# EAGLE design NXPESC-UF1_test003 (EAGLE 7.3.0)

## Sheet 1 of 3
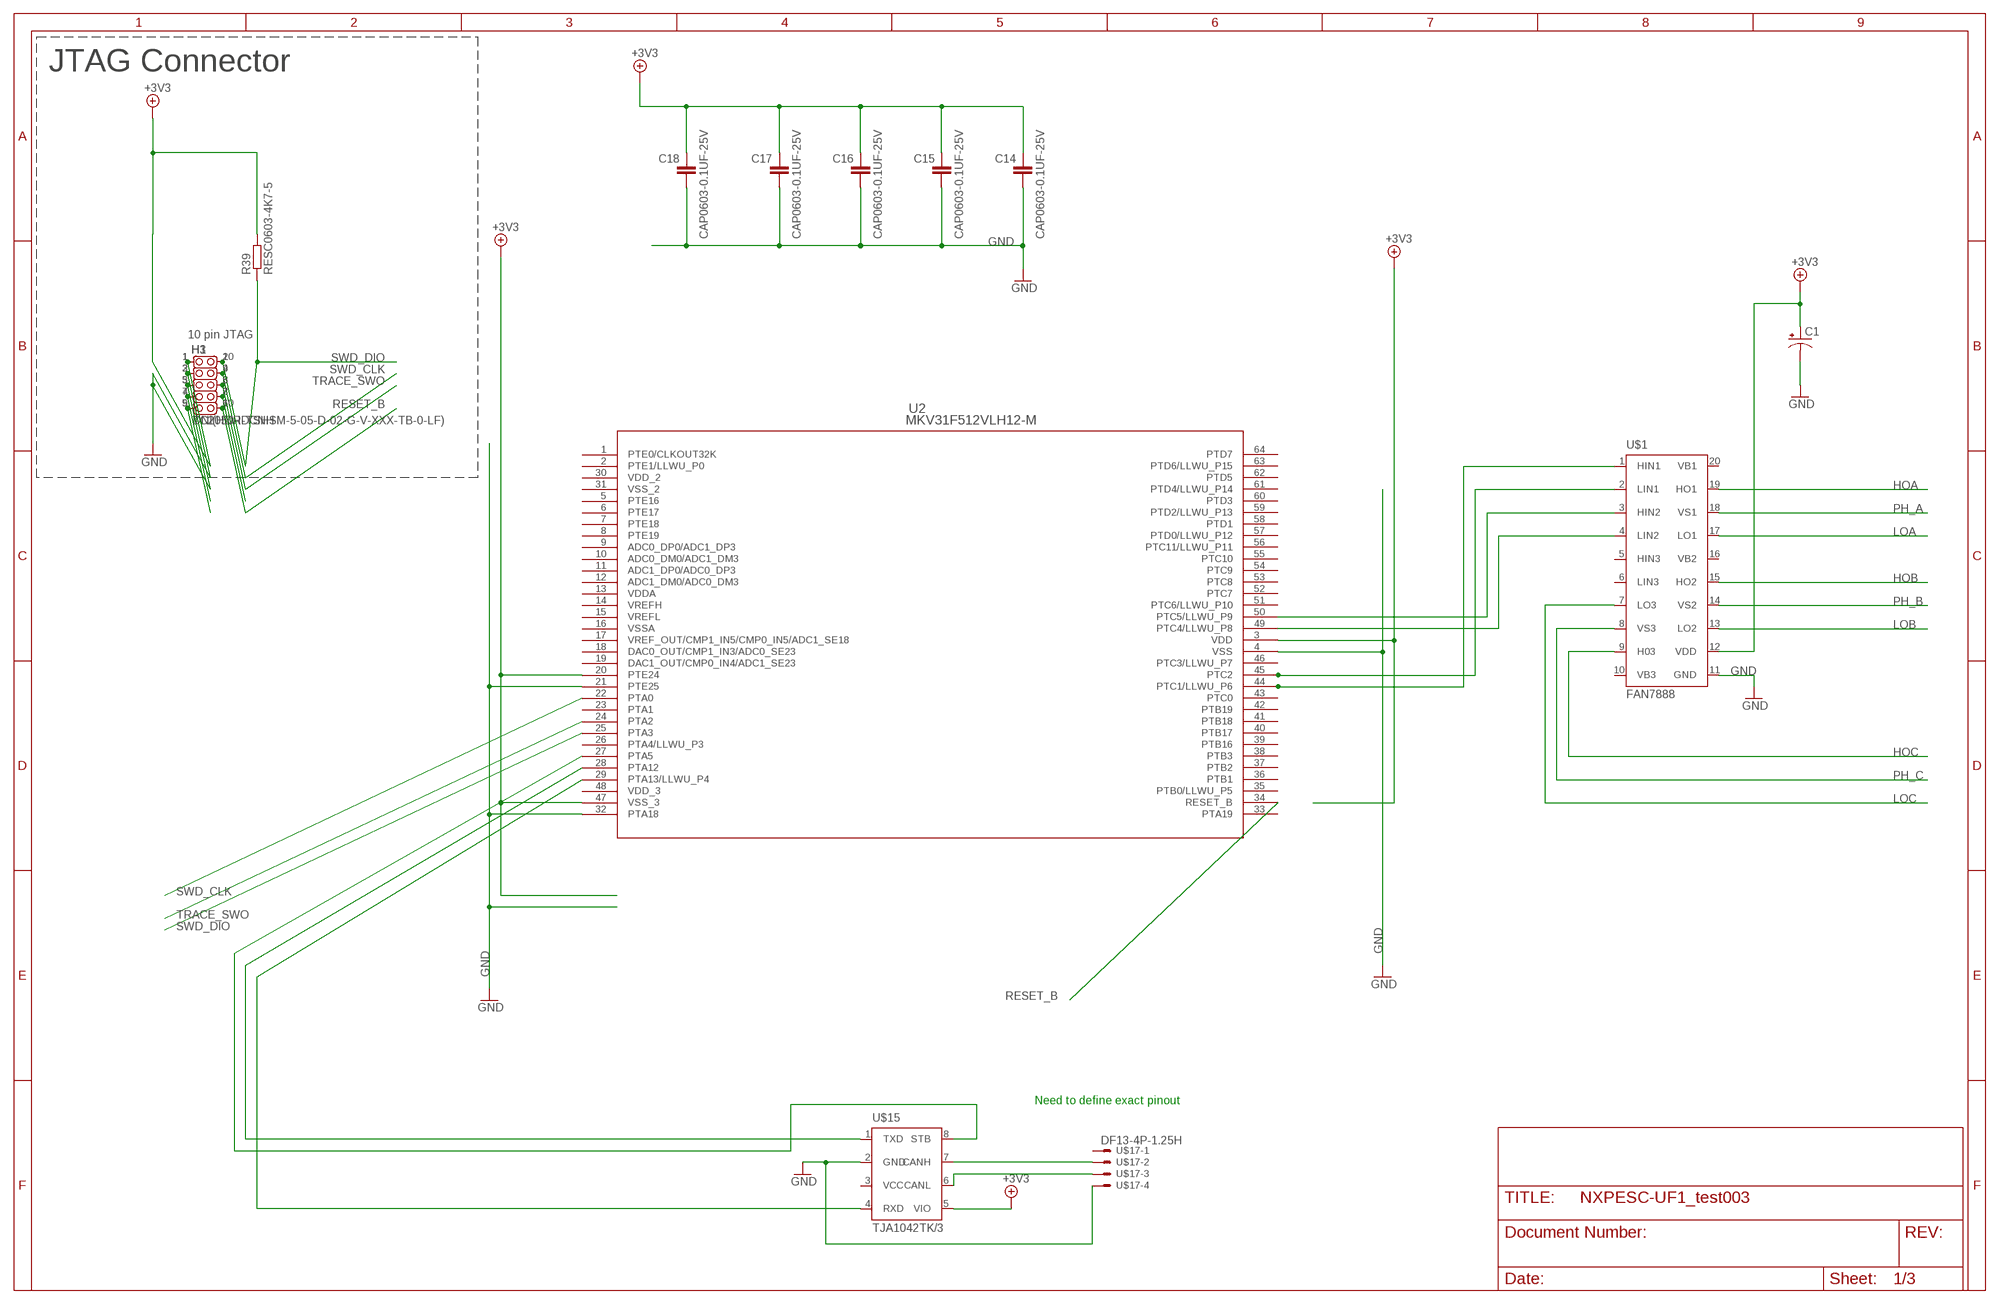
[diagram p0: schematic, sheet 1]

### Parts
C1  CAP_POL1206  [EIA3216]
C14  CAP0603-0.1UF-25V  [C0603]
C15  CAP0603-0.1UF-25V  [C0603]
C16  CAP0603-0.1UF-25V  [C0603]
C17  CAP0603-0.1UF-25V  [C0603]
C18  CAP0603-0.1UF-25V  [C0603]
H1  DNI(HDR-TSHSM-5-05-D-02-G-V-XXX-TB-0-LF)  HDR-TSHSM-5-05-D-02-G-V-XXX-TB-0-LF  [HD2X5-SMD-0.05"]
H3  TC2050-IDCNH  [TC2050-IDC-NOHOLES]
R39  RESC0603-4K7-5  [C0603]
U2  MKV31F512VLH12-M  [LQFP-64_10X10X1_6-M]
U$1  FAN7888  [SOIC-20]
U$15  TJA1042TK/3  [HVSON8]
U$17  DF13-4P-1.25H  [DF13A-4P-1.25H]

### Nets
+3V3: C1.A(+) C14.1 C15.1 C16.1 C17.1 C18.1 H1.1 H3.1(VCC) R39.2 U2.3(VDD) U2.20(PTE24) U2.47(VSS_3) U$1.12(VDD) U$15.5(VIO) ; also sheet 2
CAN0_RX: U2.29(PTA13/LLWU_P4) U$15.4(RXD)
CAN0_TX: U2.28(PTA12) U$15.1(TXD)
GND: C1.C(-) C14.2 C15.2 C16.2 C17.2 C18.2 H1.3 H1.5 H3.2(TMS) H3.3(GND) U2.4(VSS) U2.21(PTE25) U2.32(PTA18) U$1.11(GND) U$15.2(GND) U$17.4 ; also sheet 2
HOA: U$1.19(HO1) ; also sheet 2
HOB: U$1.15(HO2) ; also sheet 2
HOC: U$1.9(H03) ; also sheet 2
LOA: U$1.17(LO1) ; also sheet 2
LOB: U$1.13(LO2) ; also sheet 2
LOC: U$1.7(LO3) ; also sheet 2
N$5: U2.44(PTC1/LLWU_P6) U$1.1(HIN1)
N$6: U2.45(PTC2) U$1.2(LIN1)
N$7: U2.50(PTC5/LLWU_P9) U$1.3(HIN2)
N$8: U2.49(PTC4/LLWU_P8) U$1.4(LIN2)
N$15: H1.7 H3.4(TCK)
N$16: H1.8 H3.7(NOTUSED)
N$18: H1.9 H3.5(GND/+5V)
N$22: U$15.7(CANH) U$17.2
N$23: U$15.6(CANL) U$17.3
PH_A: U$1.18(VS1) ; also sheet 2
PH_B: U$1.14(VS2) ; also sheet 2
PH_C: U$1.8(VS3) ; also sheet 2
RESET_B: H1.10 H3.6(TDO) U2.34(RESET_B)
STB: U2.27(PTA5) U$15.8(STB)
SWD_CLK: H1.4 H3.9(NOTUSED) U2.22(PTA0)
SWD_DIO: H1.2 H3.10(RESET) R39.1 U2.25(PTA3)
TRACE_SWO: H1.6 H3.8(TDI) U2.24(PTA2)
Unconnected: U2.1(PTE0/CLKOUT32K) U2.2(PTE1/LLWU_P0) U2.5(PTE16) U2.6(PTE17) U2.7(PTE18) U2.8(PTE19) U2.9(ADC0_DP0/ADC1_DP3) U2.10(ADC0_DM0/ADC1_DM3) U2.11(ADC1_DP0/ADC0_DP3) U2.12(ADC1_DM0/ADC0_DM3) U2.17(VREF_OUT/CMP1_IN5/CMP0_IN5/ADC1_SE18) U2.18(DAC0_OUT/CMP1_IN3/ADC0_SE23) U2.19(DAC1_OUT/CMP0_IN4/ADC1_SE23) U2.23(PTA1) U2.26(PTA4/LLWU_P3) U2.33(PTA19) U2.35(PTB0/LLWU_P5) U2.36(PTB1) U2.37(PTB2) U2.38(PTB3) U2.39(PTB16) U2.40(PTB17) U2.41(PTB18) U2.42(PTB19) U2.43(PTC0) U2.46(PTC3/LLWU_P7) U2.51(PTC6/LLWU_P10) U2.52(PTC7) U2.53(PTC8) U2.54(PTC9) U2.55(PTC10) U2.56(PTC11/LLWU_P11) U2.57(PTD0/LLWU_P12) U2.58(PTD1) U2.59(PTD2/LLWU_P13) U2.60(PTD3) U2.61(PTD4/LLWU_P14) U2.62(PTD5) U2.63(PTD6/LLWU_P15) U2.64(PTD7) U$1.5(HIN3) U$1.6(LIN3) U$17.1

### Notes on the sheet
- JTAG Connector
- 10 pin JTAG
- Need to define exact pinout

## Sheet 2 of 3
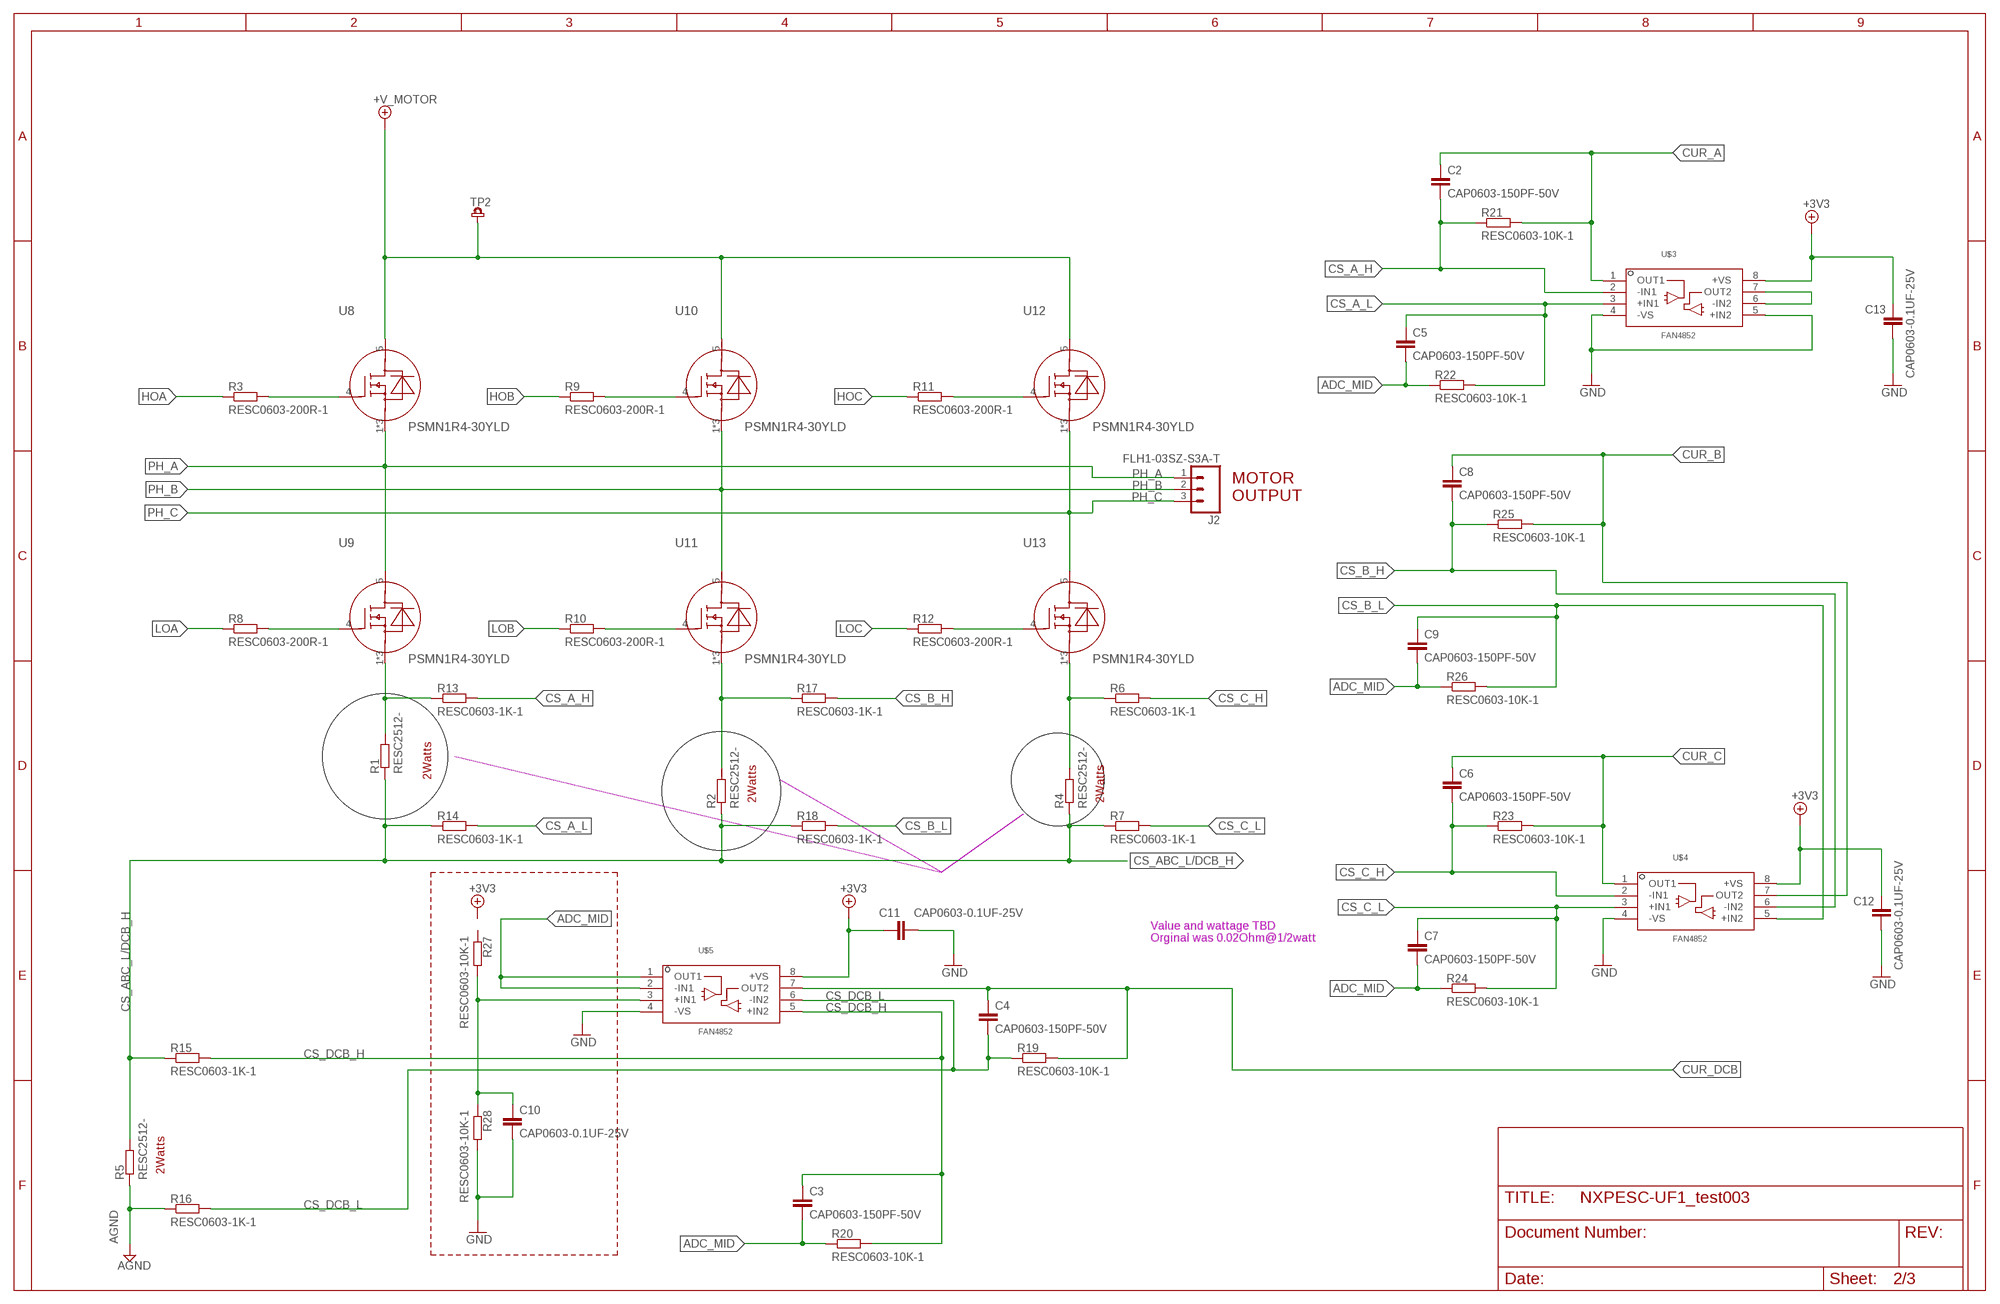
[diagram p1: schematic, sheet 2]

### Parts
C2  CAP0603-150PF-50V  [C0603]
C3  CAP0603-150PF-50V  [C0603]
C4  CAP0603-150PF-50V  [C0603]
C5  CAP0603-150PF-50V  [C0603]
C6  CAP0603-150PF-50V  [C0603]
C7  CAP0603-150PF-50V  [C0603]
C8  CAP0603-150PF-50V  [C0603]
C9  CAP0603-150PF-50V  [C0603]
C10  CAP0603-0.1UF-25V  [C0603]
C11  CAP0603-0.1UF-25V  [C0603]
C12  CAP0603-0.1UF-25V  [C0603]
C13  CAP0603-0.1UF-25V  [C0603]
J2  FLH1-03SZ-S3A-T  [J3]
R1  RESC2512-  [R2512]
R2  RESC2512-  [R2512]
R3  RESC0603-200R-1  [C0603]
R4  RESC2512-  [R2512]
R5  RESC2512-  [R2512]
R6  RESC0603-1K-1  [C0603]
R7  RESC0603-1K-1  [C0603]
R8  RESC0603-200R-1  [C0603]
R9  RESC0603-200R-1  [C0603]
R10  RESC0603-200R-1  [C0603]
R11  RESC0603-200R-1  [C0603]
R12  RESC0603-200R-1  [C0603]
R13  RESC0603-1K-1  [C0603]
R14  RESC0603-1K-1  [C0603]
R15  RESC0603-1K-1  [C0603]
R16  RESC0603-1K-1  [C0603]
R17  RESC0603-1K-1  [C0603]
R18  RESC0603-1K-1  [C0603]
R19  RESC0603-10K-1  [C0603]
R20  RESC0603-10K-1  [C0603]
R21  RESC0603-10K-1  [C0603]
R22  RESC0603-10K-1  [C0603]
R23  RESC0603-10K-1  [C0603]
R24  RESC0603-10K-1  [C0603]
R25  RESC0603-10K-1  [C0603]
R26  RESC0603-10K-1  [C0603]
R27  RESC0603-10K-1  [C0603]
R28  RESC0603-10K-1  [C0603]
TP2  TP-TH-SMLL  [TP-SMLL]
U8  PSMN1R4-30YLD  [LFPAK56]
U9  PSMN1R4-30YLD  [LFPAK56]
U10  PSMN1R4-30YLD  [LFPAK56]
U11  PSMN1R4-30YLD  [LFPAK56]
U12  PSMN1R4-30YLD  [LFPAK56]
U13  PSMN1R4-30YLD  [LFPAK56]
U$3  FAN4852  [SOP65P490X110-8N]
U$4  FAN4852  [SOP65P490X110-8N]
U$5  FAN4852  [SOP65P490X110-8N]

### Nets
+3V3: C11.1 C12.1 C13.1 U$3.8(+VS) U$4.8(+VS) U$5.8(+VS) ; also sheet 1
+V_MOTOR: TP2.1 U8.5(D) U10.5(D) U12.5(D)
ADC_MID: C3.2 C5.2 C7.2 C9.2 R20.1 R22.1 R24.1 R26.1 U$5.1(OUT1) U$5.2(-IN1)
AGND: R5.1 R16.1
CS_A_H: C2.2 R13.2 R21.1 U$3.2(-IN1)
CS_A_L: C5.1 R14.2 R22.2 U$3.3(+IN1)
CS_ABC_L/DCB_H: R1.1 R2.1 R4.1 R5.2 R7.1 R14.1 R15.1 R18.1
CS_B_H: C8.2 R17.2 R25.1 U$4.6(-IN2)
CS_B_L: C9.1 R18.2 R26.2 U$4.5(+IN2)
CS_C_H: C6.2 R6.2 R23.1 U$4.2(-IN1)
CS_C_L: C7.1 R7.2 R24.2 U$4.3(+IN1)
CS_DCB_H: C3.1 R15.2 R20.2 U$5.5(+IN2)
CS_DCB_L: C4.2 R16.2 R19.1 U$5.6(-IN2)
CUR_A: C2.1 R21.2 U$3.1(OUT1)
CUR_B: C8.1 R25.2 U$4.7(OUT2)
CUR_C: C6.1 R23.2 U$4.1(OUT1)
CUR_DCB: C4.1 R19.2 U$5.7(OUT2)
GND: C10.2 C11.2 C12.2 C13.2 R28.2 U$3.4(-VS) U$3.5(+IN2) U$4.4(-VS) U$5.4(-VS) ; also sheet 1
HOA: R3.1 ; also sheet 1
HOB: R9.1 ; also sheet 1
HOC: R11.1 ; also sheet 1
LOA: R8.1 ; also sheet 1
LOB: R10.1 ; also sheet 1
LOC: R12.1 ; also sheet 1
N$1: R3.2 U8.4(G)
N$2: R1.2 R13.1 U9.1(S) U9.2(S) U9.3(S)
N$3: R8.2 U9.4(G)
N$4: R9.2 U10.4(G)
N$9: R10.2 U11.4(G)
N$10: R11.2 U12.4(G)
N$11: R2.2 R17.1 U11.1(S) U11.2(S) U11.3(S)
N$12: R4.2 R6.1 U13.1(S) U13.2(S) U13.3(S)
N$13: U$3.6(-IN2) U$3.7(OUT2)
N$14: C10.1 R27.2 R28.1 U$5.3(+IN1)
N$17: R12.2 U13.4(G)
PH_A: J2.1 U8.1(S) U8.2(S) U8.3(S) U9.5(D) ; also sheet 1
PH_B: J2.2 U10.1(S) U10.2(S) U10.3(S) U11.5(D) ; also sheet 1
PH_C: J2.3 U12.1(S) U12.2(S) U12.3(S) U13.5(D) ; also sheet 1
Unconnected: R27.1

### Notes on the sheet
- MOTOR
  OUTPUT
- 2Watts
- 2Watts | 2Watts
- Value and wattage TBD
  Orginal was 0.02Ohm@1/2watt
- 2Watts

## Sheet 3 of 3
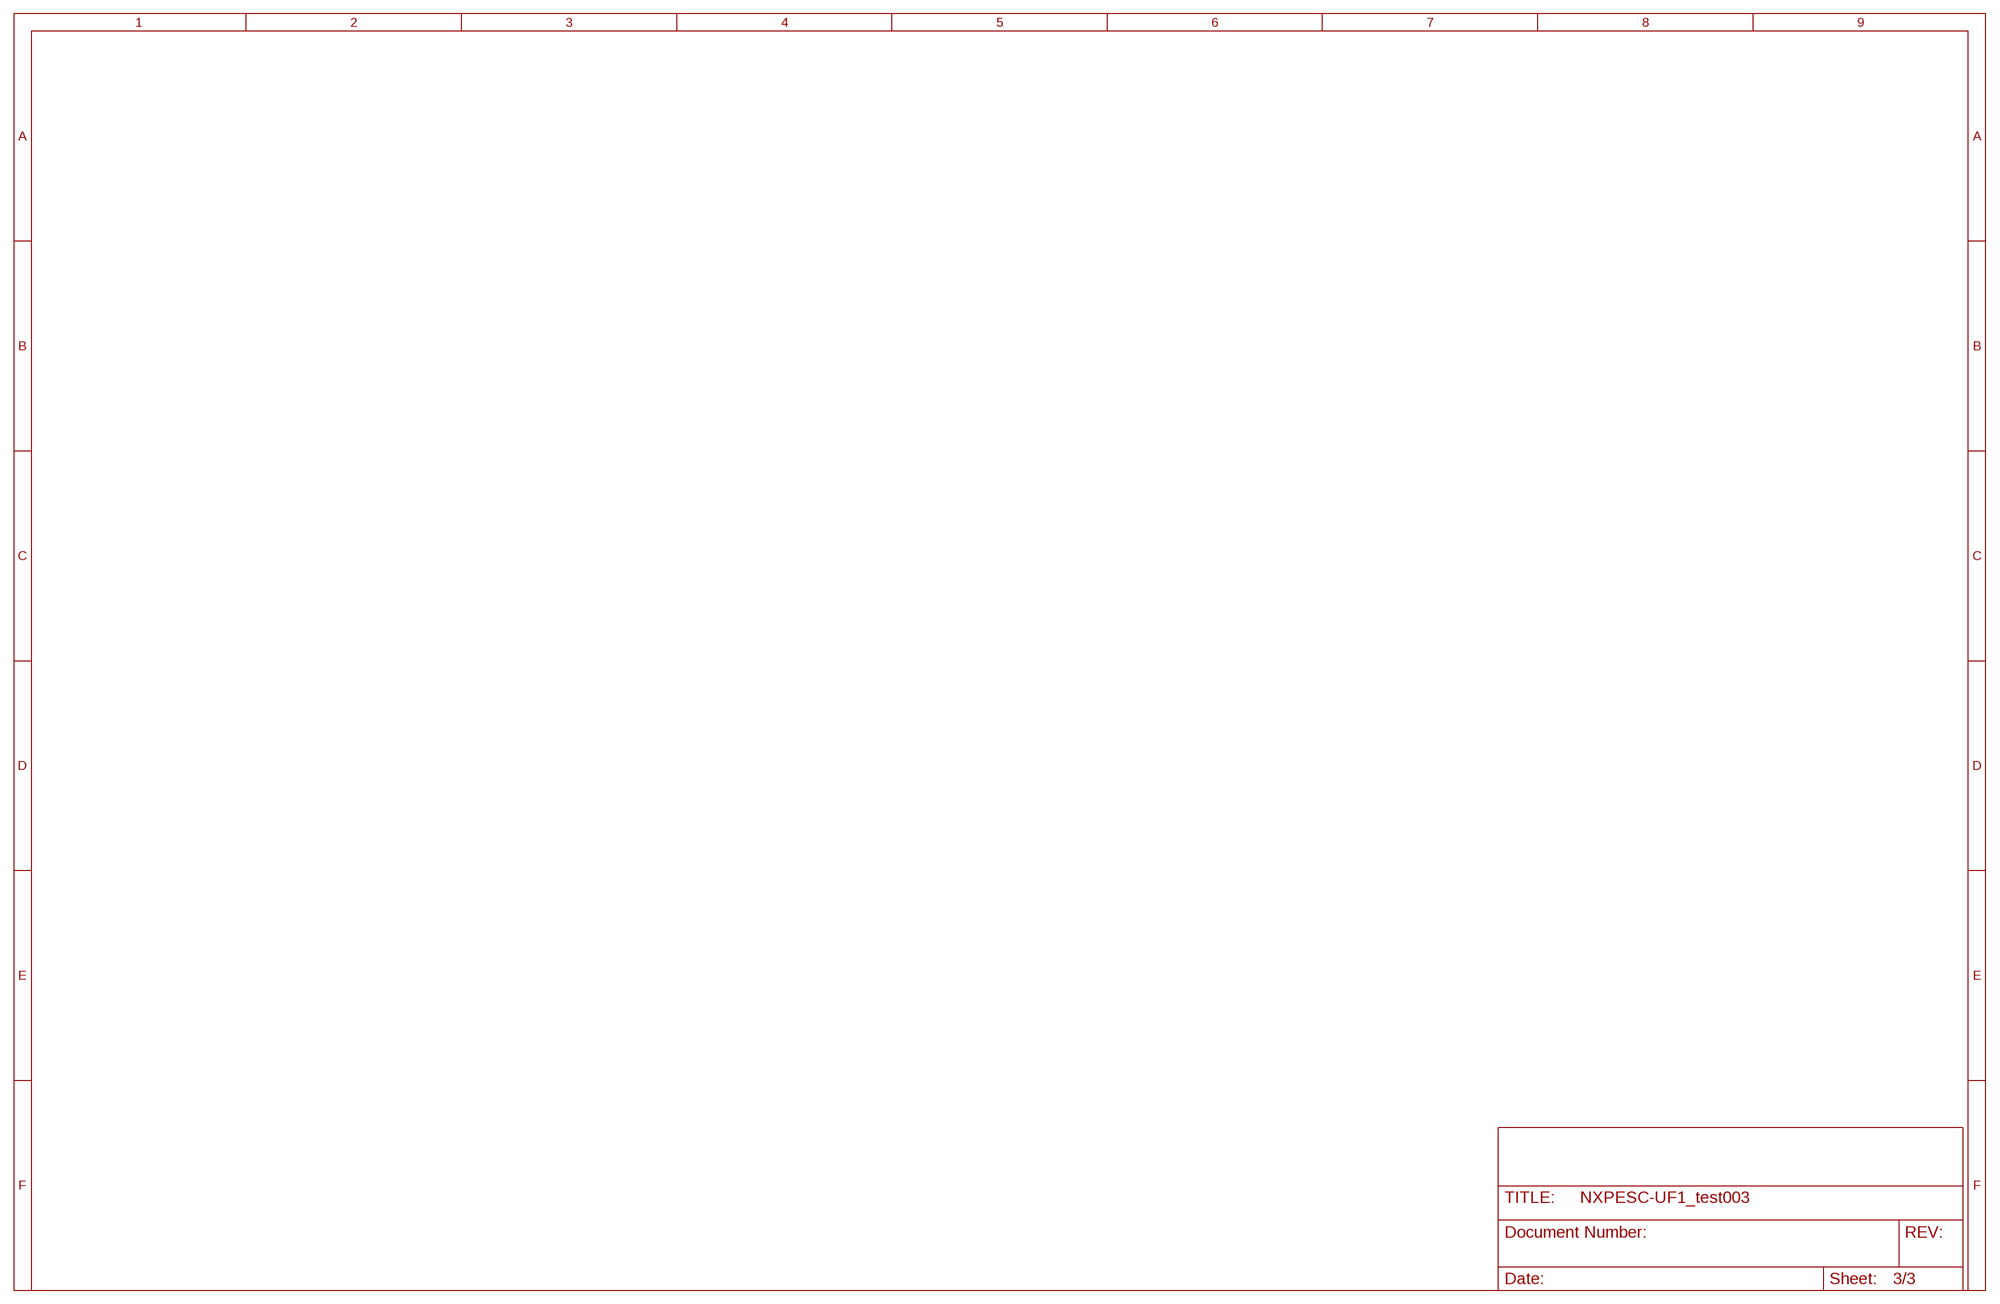
[diagram p2: schematic, sheet 3]

## Power pins joined to a net without a drawn wire
VB1: U$1.20(VB1)
VB2: U$1.16(VB2)
VB3: U$1.10(VB3)
VCC: U$15.3(VCC)
VDD_2: U2.30(VDD_2)
VDD_3: U2.48(VDD_3)
VDDA: U2.13(VDDA)
VREFH: U2.14(VREFH)
VREFL: U2.15(VREFL)
VSS_2: U2.31(VSS_2)
VSSA: U2.16(VSSA)

## Library data of the parts
C1 = pixhawk2:CAP_POL: Capacitor Polarized These are standard SMD and PTH capacitors. Normally 10uF, 47uF, and 100uF in electrolytic and tantalum varieties. Always verify the external diameter of the through hole cap, it varies with capacity, voltage, and manufacturer. The EIA devices should be standard.
C2-C18 = etc-rcl:CAP?-*: Capacitors with ETC part numbers. package 1812 are actually 1808 Y capacitors
H1 = etc-connector-002a:HDR-TSHSM-5-*-D-02-G-V-XXX-TB-0-LF: Product Number: TSHSM-5-DV Terminal strip header Pitch: .050" x .050" Pin length: .065-.393 Pins per row: 01-40 Surface mount Dual row Straight Termination Type: PCB
H3 = etc-connector-003a:TC2050-IDC: The TC2050-ARM2010 is a Tag-Connect adapter board allowing our TC2050-IDC cables to be used for ARM JTAG and ARM SWD (Serial Wire Debug) applications. Although intended for use with our patented TC2050-IDC Plug-of-Nails™ Cables, the adapter may be useful to people wishing to use 10-pin 0.1” ribbon headers on their PCB.
J2 = etc-connector-003a:FLH1-03SZ-S3A-T: Molex 3-pin single row friction lock pin header.
R1-R28 = etc-rcl:RESC?-*: Resistors with ETC part numbers.
R39 = etc_rcl:RESC?-*: Resistors with ETC part numbers.
TP2 = etc-connector-003a:TP-TH-SMLL
U2 = MKV31F512VLH12:MKV31F512VLH12
U8-U13 = PSMN1R2-25YL_115:PSMN1R4-30YLD: NXP PSMN1R4
U$1 = FAN7888:FAN7888
U$3-U$5 = NXPHLITE:FAN4852: FAN4852 9MHz Low-Power Dual CMOS Amplifier The FAN4852 is a dual, rail-to-rail output, low-power, CMOS amplifier that consumes only 800µA of supply current, while providing ±50mA of output short-circuit current. This amplifier is designed to operate supplies from 2.5V to 5V. Additionally, the FAN4852 is EMI hardened, which minimizes EMI interference. It has a maximum input offset voltage of 1mV and an input common-mode range that includes ground. The FAN4852 is designed on a CMOS process and provides 9MHz of bandwidth and 6V/µs of slew rate. The combination of low-power, low-voltage operation and a small package make this amplifier well suited for general-purpose and battery-powered applications.
U$15 = TJA1042T:TJA1042T
U$17 = pixhawk2:DF13-4P-1.25?

## Board
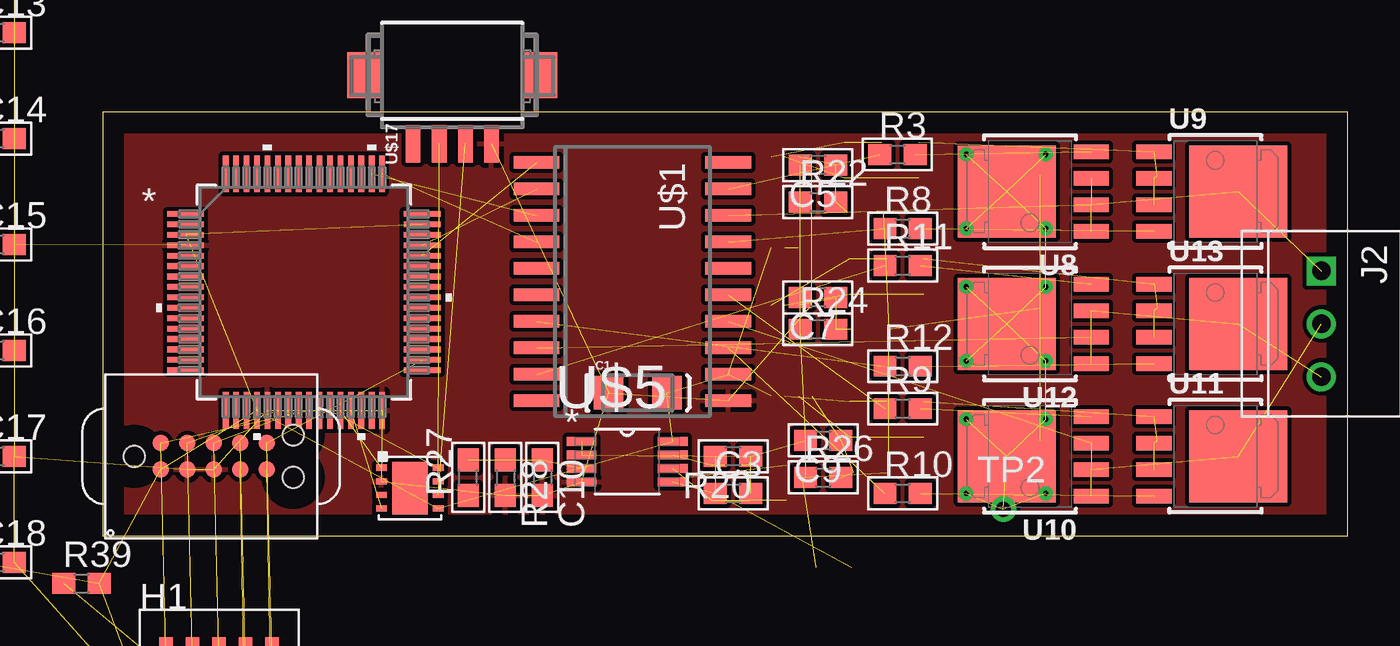
[diagram p3: board, top side]
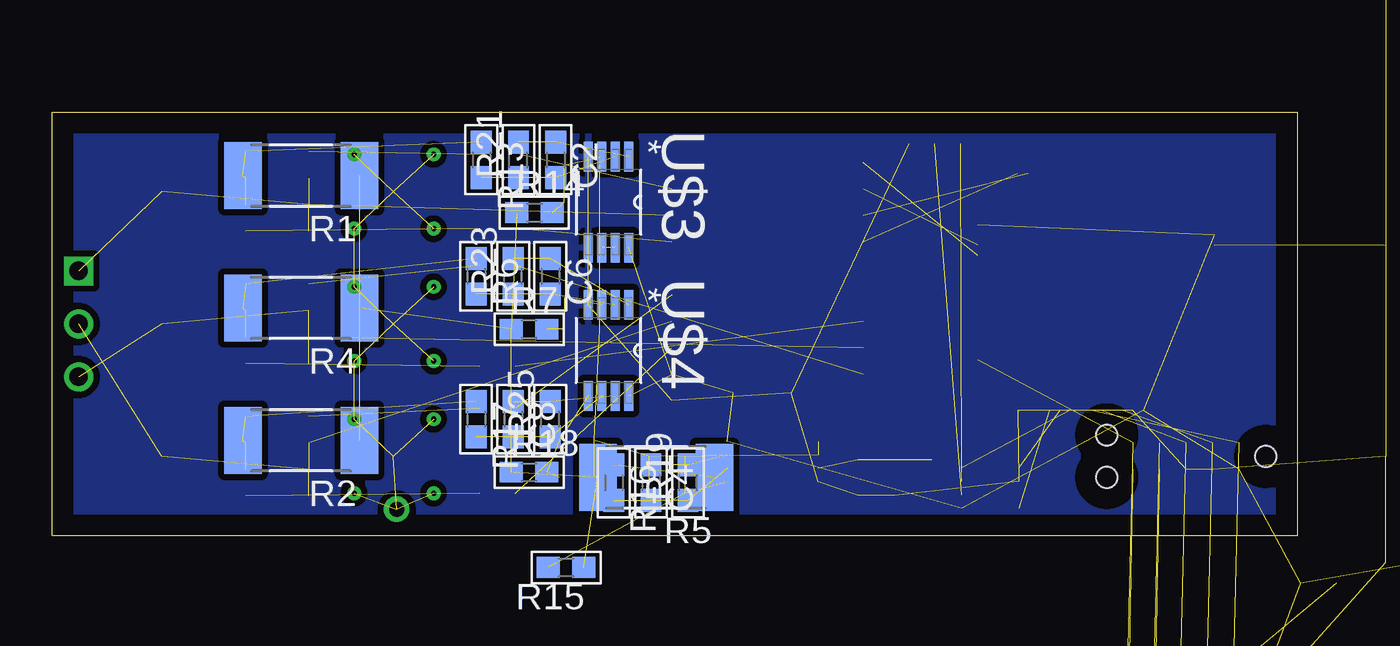
[diagram p4: board, bottom side, seen from below]

Size 59.69 x 20.32 mm. Coordinates in mm from the lower left corner, seen from the top.
Outline: 0,0 59.69,0 59.69,20.32 0,20.32 0,0
Copper layers (1*16): Top 0.035mm / dielectric 1.5mm / Bottom 0.035mm
Design rules "default": minimum track width 10mil, minimum drill 0.6mm, track to track 8mil, track to pad 8mil, pad to pad 8mil, via to via 8mil, smd to smd 8mil, copper to edge 40mil, drill to drill 8mil, minimum pad ring 10mil, minimum via ring 8mil, stop-mask expansion 4mil, vias tented up to drill 0mil, thermal gap 10mil

### Footprints (pad centres in the part's own frame; a part is rotated, then mirrored left to right if it is on the bottom)
EIA3216 = smd 1.4 x 1.6: A 1.4,0; C -1.4,0
C0603 = smd 1.1 x 1: 1 -0.85,0; 2 0.85,0
HD2X5-SMD-0.05" = smd 0.648 x 3.023: 1 -2.54,-2.254; 2 -2.54,2.254; 3 -1.27,-2.254; 4 -1.27,2.254; 5 0,-2.254; 6 0,2.254; 7 1.27,-2.254; 8 1.27,2.254; 9 2.54,-2.254; 10 2.54,2.254
TC2050-IDC-NOHOLES = smd 0.787 x 0.787: 1 1.27,-0.635; 2 2.54,-0.635; 3 3.81,-0.635; 4 5.08,-0.635; 5 6.35,-0.635; 6 6.35,0.635; 7 5.08,0.635; 8 3.81,0.635; 9 2.54,0.635; 10 1.27,0.635 | hole 0.991: 0,0; 7.62,1.016; 7.62,-1.016
J3 = drill 0.889 square: 1 -2.54,0 | drill 0.889: 2 0,0; 3 2.54,0
R2512 = smd 1.8 x 3.2: 1 -2.8,0; 2 2.8,0
TP-SMLL = drill 0.711 pad 1.016: 1 0,0
LQFP-64_10X10X1_6-M = smd 1.766 x 0.27: 1 -5.676,3.75; 2 -5.676,3.25; 3 -5.676,2.75; 4 -5.676,2.25; 5 -5.676,1.75; 6 -5.676,1.25; 7 -5.676,0.75; 8 -5.676,0.25; 9 -5.676,-0.25; 10 -5.676,-0.75; 11 -5.676,-1.25; 12 -5.676,-1.75; 13 -5.676,-2.25; 14 -5.676,-2.75; 15 -5.676,-3.25; 16 -5.676,-3.75; 33 5.676,-3.75; 34 5.676,-3.25; 35 5.676,-2.75; 36 5.676,-2.25; 37 5.676,-1.75; 38 5.676,-1.25; 39 5.676,-0.75; 40 5.676,-0.25; 41 5.676,0.25; 42 5.676,0.75; 43 5.676,1.25; 44 5.676,1.75; 45 5.676,2.25; 46 5.676,2.75; 47 5.676,3.25; 48 5.676,3.75 | smd 0.27 x 1.766: 17 -3.75,-5.676; 18 -3.25,-5.676; 19 -2.75,-5.676; 20 -2.25,-5.676; 21 -1.75,-5.676; 22 -1.25,-5.676; 23 -0.75,-5.676; 24 -0.25,-5.676; 25 0.25,-5.676; 26 0.75,-5.676; 27 1.25,-5.676; 28 1.75,-5.676; 29 2.25,-5.676; 30 2.75,-5.676; 31 3.25,-5.676; 32 3.75,-5.676; 49 3.75,5.676; 50 3.25,5.676; 51 2.75,5.676; 52 2.25,5.676; 53 1.75,5.676; 54 1.25,5.676; 55 0.75,5.676; 56 0.25,5.676; 57 -0.25,5.676; 58 -0.75,5.676; 59 -1.25,5.676; 60 -1.75,5.676; 61 -2.25,5.676; 62 -2.75,5.676; 63 -3.25,5.676; 64 -3.75,5.676
LFPAK56 = smd 0.7 x 1.7: 1 -1.905,-2.94; 2 -0.635,-2.94; 3 0.635,-2.94; 4 1.905,-2.94 | smd 4.4 x 4.7: 5 0,1.1
SOIC-20 = smd 0.6 x 2.2: 1 -5.715,-4.6; 2 -4.445,-4.6; 3 -3.175,-4.6; 4 -1.905,-4.6; 5 -0.635,-4.6; 6 0.635,-4.6; 7 1.905,-4.6; 8 3.175,-4.6; 9 4.445,-4.6; 10 5.715,-4.6; 11 5.715,4.6; 12 4.445,4.6; 13 3.175,4.6; 14 1.905,4.6; 15 0.635,4.6; 16 -0.635,4.6; 17 -1.905,4.6; 18 -3.175,4.6; 19 -4.445,4.6; 20 -5.715,4.6
SOP65P490X110-8N = smd 1.422 x 0.432: 1 -2.184,0.965; 2 -2.184,0.33; 3 -2.184,-0.33; 4 -2.184,-0.965; 5 2.184,-0.965; 6 2.184,-0.33; 7 2.184,0.33; 8 2.184,0.965
HVSON8 = smd 0.3 x 0.525: 1 -0.975,-1.363; 2 -0.325,-1.363; 3 0.325,-1.363; 4 0.975,-1.363; 5 0.975,1.363; 6 0.325,1.363; 7 -0.325,1.363; 8 -0.975,1.363 | smd 2.5 x 1.7: P$1 0,0
DF13A-4P-1.25H = smd 0.7 x 1.8: 1 -1.875,-3.3; 2 -0.625,-3.3; 3 0.625,-3.3; 4 1.875,-3.3 | smd 1.6 x 2.2: S1 4.225,0; S2 -4.225,0

### Placement (x,y rotation side)
C1  25.65,6.86 0 top
C2  35.56,18.03 270 bottom
C3  30.23,2.03 0 top
C4  30.99,2.54 270 bottom
C5  34.29,17.78 180 top
C6  35.81,12.45 270 bottom
C7  34.29,11.43 180 top
C8  37.59,5.59 270 bottom
C9  34.54,4.57 180 top
C10  21.08,2.79 270 top
C11  -5.08,34.29 0 top  (outside the outline)
C12  -5.08,29.21 0 top  (outside the outline)
C13  -5.08,24.13 0 top  (outside the outline)
C14  -5.08,19.05 0 top  (outside the outline)
C15  -5.08,13.97 0 top  (outside the outline)
C16  -5.08,8.89 0 top  (outside the outline)
C17  -5.08,3.81 0 top  (outside the outline)
C18  -5.08,-1.27 0 top  (outside the outline)
H1  5.59,-8.64 0 top  (outside the outline)
H3  1.52,3.81 0 top
J2  58.42,10.16 270 top
R1  47.75,17.27 180 bottom
R2  47.75,4.57 180 bottom
R3  38.1,18.29 0 top
R4  47.75,10.92 180 bottom
R5  30.73,2.79 180 bottom
R6  39.37,12.45 270 bottom
R7  36.83,9.91 0 bottom
R8  38.35,14.73 0 top
R9  38.35,6.1 0 top
R10  38.35,2.03 0 top
R11  38.35,12.95 0 top
R12  38.35,8.13 0 top
R13  39.12,18.03 270 bottom
R14  36.58,15.49 0 bottom
R15  35.05,-1.52 180 bottom
R16  32.77,2.54 270 bottom
R17  39.37,5.59 270 bottom
R18  36.83,3.05 0 bottom
R19  29.21,2.54 90 bottom
R20  30.23,3.81 180 top
R21  37.34,18.03 90 bottom
R22  34.29,16 0 top
R23  37.59,12.45 90 bottom
R24  34.29,9.91 0 top
R25  35.81,5.59 90 bottom
R26  34.54,2.79 0 top
R27  17.53,2.79 90 top
R28  19.3,2.79 270 top
R39  -1.02,-2.29 0 top
TP2  43.18,1.27 0 top
U2  9.65,11.68 0 top
U8  44.45,16.51 90 top
U9  53.34,16.51 270 top
U10  44.45,3.81 90 top
U11  53.34,3.81 270 top
U12  44.45,10.16 90 top
U13  53.34,10.16 270 top
U$1  25.4,12.19 270 top
U$3  33.02,16 270 bottom
U$4  33.02,8.89 270 bottom
U$5  25.15,3.56 0 top
U$15  14.73,2.29 270 top
U$17  16.76,22.1 0 top

### Tracks (layer width: path | path; a pad name or v marks a point on that pad's centre or on a via)
+3V3  (19 unrouted)
+V_MOTOR  (via drill 0.25)  (15 unrouted)
  other vias: 41.4,18.29 41.4,14.73 45.21,14.73 45.21,18.29 45.21,5.59 45.21,2.03 41.4,2.03 41.4,5.59 41.4,11.94 41.4,8.38 45.21,8.38 45.21,11.94
ADC_MID  (9 unrouted)
AGND  (1 unrouted)
CAN0_RX  (1 unrouted)
CAN0_TX  (1 unrouted)
CS_A_H  (3 unrouted)
CS_A_L  (3 unrouted)
CS_ABC_L/DCB_H  (7 unrouted)
CS_B_H  (3 unrouted)
CS_B_L  (3 unrouted)
CS_C_H  (3 unrouted)
CS_C_L  (3 unrouted)
CS_DCB_H  (3 unrouted)
CS_DCB_L  (3 unrouted)
CUR_A  (2 unrouted)
CUR_B  (2 unrouted)
CUR_C  (2 unrouted)
CUR_DCB  (2 unrouted)
GND  (24 unrouted)
  pour Bottom (isolate 0.305, rank 3): -1.27,27.94 62.23,27.94 62.23,-2.54 -1.27,-2.54
  pour Top (rank 3): -2.54,27.94 63.5,27.94 63.5,-1.27 -2.54,-1.27
HOA  (1 unrouted)
HOB  (1 unrouted)
HOC  (1 unrouted)
LOA  (1 unrouted)
LOB  (1 unrouted)
LOC  (1 unrouted)
N$1  (1 unrouted)
N$2  (4 unrouted)
N$3  (1 unrouted)
N$4  (1 unrouted)
N$5  (1 unrouted)
N$6  (1 unrouted)
N$7  (1 unrouted)
N$8  (1 unrouted)
N$9  (1 unrouted)
N$10  (1 unrouted)
N$11  (4 unrouted)
N$12  (4 unrouted)
N$13  (1 unrouted)
N$14  (3 unrouted)
N$15  (1 unrouted)
N$16  (1 unrouted)
N$17  (1 unrouted)
N$18  (1 unrouted)
N$22  (1 unrouted)
N$23  (1 unrouted)
PH_A  (5 unrouted)
PH_B  (5 unrouted)
PH_C  (5 unrouted)
RESET_B  (2 unrouted)
STB  (1 unrouted)
SWD_CLK  (2 unrouted)
SWD_DIO  (3 unrouted)
TRACE_SWO  (2 unrouted)